# Altium schematic sheet Master_Sensor.SchDoc
size A4; Organization: Altium Limited; Address1: L3, 12a Rodborough Rd; Address2: Frenchs Forest; Address3: NSW; Address4: Australia 2086
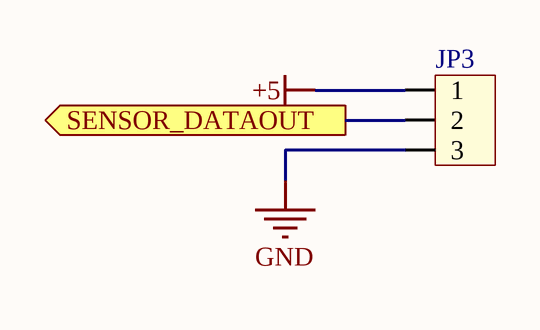
[diagram p0: Master_Sensor.SchDoc]

## Parts
JP3  JP3  [JP3H]  (value not drawn)

## Ports
SENSOR_DATAOUT (out)

## Nets
+5: JP3.1
GND: JP3.3
SENSOR_DATAOUT: JP3.2 ; port SENSOR_DATAOUT

## Notes on the sheet
- Labels drawn without touching a wire or pin: Page Contents:, Project:
- Size:
- Date:
- A4
- Ver:
- Time:
- Author:
- Checked by:
- File:

## Library data of the parts
JP3 = Con3: Connector 3; Value: Connector 3